# Altium schematic sheet P03 POWER TREE.SchDoc
size 420 x 297 mm
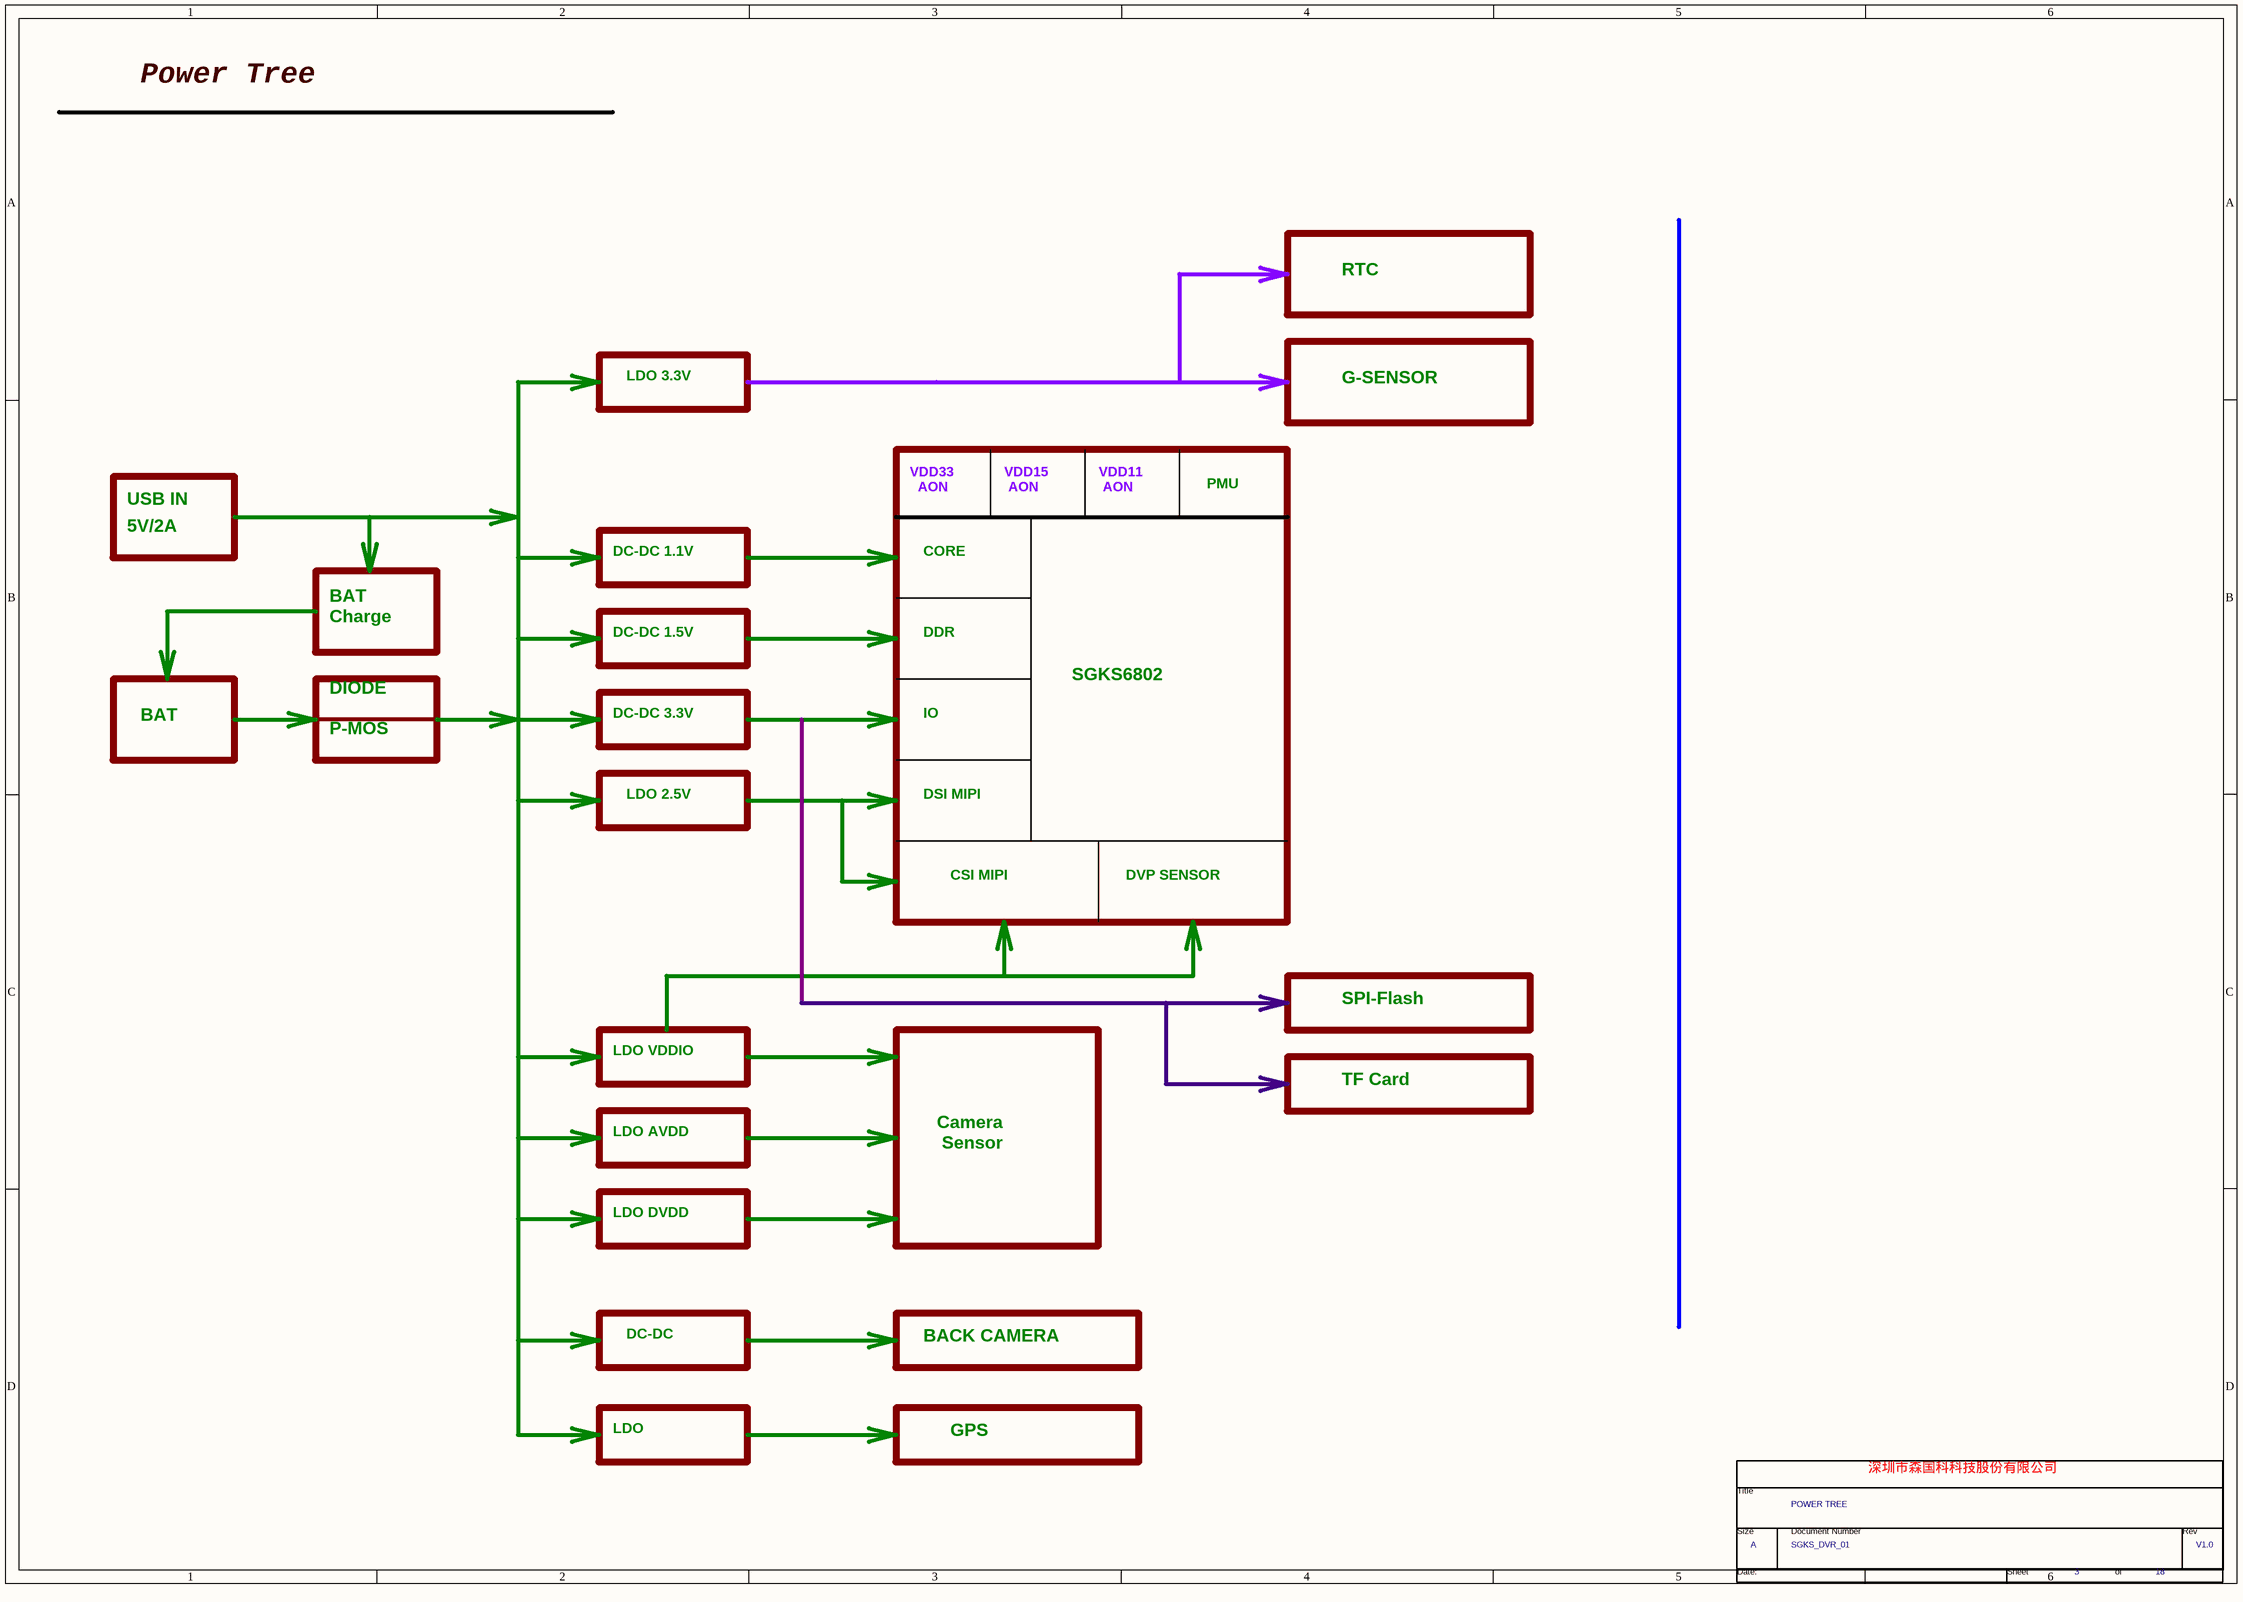
[diagram p0: P03 POWER TREE.SchDoc]

## Parts
*  Page Count: 18  Page Number: 3  Page Size: A  Title: POWER TREE  RevCode: V1.0  Doc: SGKS_DVR_01  (hidden comment: TitleBlock0)  (graphical)

## Notes on the sheet
- Power Tree
- RTC
- LDO 3.3V
- G-SENSOR
- VDD33
  AON
- VDD15
  AON
- VDD11
  AON
- USB IN
- 5V/2A
- PMU
- BAT
  Charge
- DC-DC 1.1V
- CORE
- DC-DC 1.5V
- DDR
- BAT
- DIODE
- DC-DC 3.3V
- IO
- SGKS6802
- P-MOS
- LDO 2.5V
- DSI MIPI
- CSI MIPI
- DVP SENSOR
- LDO VDDIO
- SPI-Flash
- LDO AVDD
- Camera
  Sensor
- TF Card
- LDO DVDD
- DC-DC
- BACK CAMERA
- LDO
- GPS
- 深圳市森国科科技股份有限公司
- (in symbol TitleBlock0) Title; Size; Document Number; Rev; Date:; Sheet; of

## Library data of the parts
* = TitleBlock0: Page Create Date: March  8, 1995